# Altium schematic sheet ExpandBoard-050.SchDoc
size A4
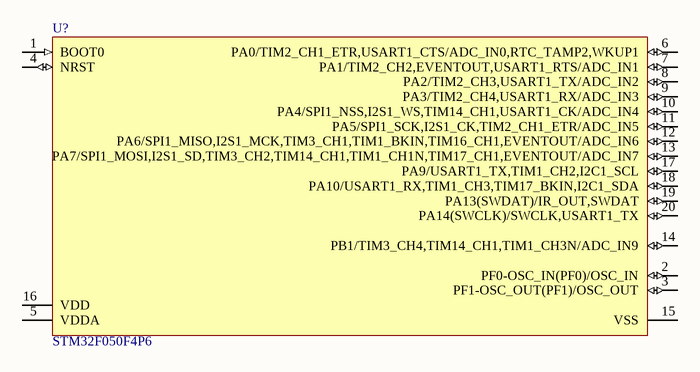
[diagram p0: ExpandBoard-050.SchDoc]

## Parts
U?  STM32F050F4P6  [STM-TSSOP20_N]

## Nets

Not connected (* = marked no-connect by the designer): U? 1(BOOT0) 2(PF0-OSC_IN(PF0)/OSC_IN) 3(PF1-OSC_OUT(PF1)/OSC_OUT) 4(NRST) 5(VDDA) 6(PA0/TIM2_CH1_ETR,USART1_CTS/ADC_IN0,RTC_TAMP2,WKUP1) 7(PA1/TIM2_CH2,EVENTOUT,USART1_RTS/ADC_IN1) 8(PA2/TIM2_CH3,USART1_TX/ADC_IN2) 9(PA3/TIM2_CH4,USART1_RX/ADC_IN3) 10(PA4/SPI1_NSS,I2S1_WS,TIM14_CH1,USART1_CK/ADC_IN4) 11(PA5/SPI1_SCK,I2S1_CK,TIM2_CH1_ETR/ADC_IN5) 12(PA6/SPI1_MISO,I2S1_MCK,TIM3_CH1,TIM1_BKIN,TIM16_CH1,EVENTOUT/ADC_IN6) 13(PA7/SPI1_MOSI,I2S1_SD,TIM3_CH2,TIM14_CH1,TIM1_CH1N,TIM17_CH1,EVENTOUT/ADC_IN7) 14(PB1/TIM3_CH4,TIM14_CH1,TIM1_CH3N/ADC_IN9) 15(VSS) 16(VDD) 17(PA9/USART1_TX,TIM1_CH2,I2C1_SCL) 18(PA10/USART1_RX,TIM1_CH3,TIM17_BKIN,I2C1_SDA) 19(PA13(SWDAT)/IR_OUT,SWDAT) 20(PA14(SWCLK)/SWCLK,USART1_TX)

## Library data of the parts
U? = STM32F050F4P6: ARM Cortex-M0 32-bit MCU, 16 KB Flash, 4 KB Internal RAM, 15 I/Os, 20-pin TSSOP, -40 to 85 degC, Tube; FLASH Size (Prog) (kB): 16; I/Os (High Current): 15; Internal RAM Size (kB): 4; Operating Frequency(F) (Processor speed) (MHz): 48; Supply Voltage(Vcc) min (V): 2; DatasheetVersion: Rev. 1; PackageVersion: Rev. 1, 11/2012; PackageReference: TSSOP20; PackageDescription: 20-Pin Thin Shrink Small Outline Package, 6.5 x 4.4 mm Body, 0.65 mm Pitch; Core: ARM Cortex-M0; Packing: Tube; Mounting Technology: Surface Mount; PartNumber: STM32F050F4P6; ComponentLink1Description: Manufacturer URL; ComponentLink1URL: http://www.st.com/web/en/home.html; ComponentLink2Description: Datasheet; ComponentLink2URL: http://www.st.com/st-web-ui/static/active/en/resource/technical/document/datasheet/DM00065136.pdf; ComponentLink3Description: Package Specification; ComponentLink3URL: http://www.st.com/st-web-ui/static/active/en/resource/technical/document/datasheet/DM00065136.pdf